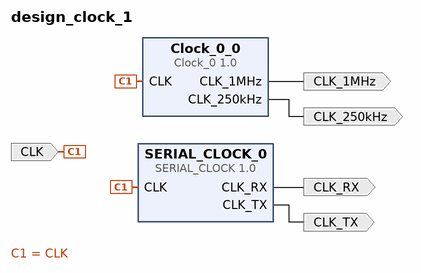
[diagram p0: block diagram of the top level]
# Vivado block design design_clock_1, xc7z020clg400-2, Vivado 2019.1
create_bd_design design_clock_1

create_bd_port -dir O CLK_RX
create_bd_port -dir O CLK_TX
create_bd_port -dir I -type clk CLK
create_bd_port -dir O CLK_250kHz
create_bd_port -dir O CLK_1MHz

create_bd_cell -type ip -vlnv xilinx.com:user:SERIAL_CLOCK:1.0 SERIAL_CLOCK_0
create_bd_cell -type ip -vlnv xilinx.com:user:Clock_0:1.0 Clock_0_0

# ---- connections ----

connect_bd_net [get_bd_pins SERIAL_CLOCK_0/CLK_RX] [get_bd_ports CLK_RX]
connect_bd_net [get_bd_pins SERIAL_CLOCK_0/CLK_TX] [get_bd_ports CLK_TX]
connect_bd_net -net CLK_0_1 [get_bd_ports CLK] [get_bd_pins SERIAL_CLOCK_0/CLK] [get_bd_pins Clock_0_0/CLK]
connect_bd_net [get_bd_pins Clock_0_0/CLK_250kHz] [get_bd_ports CLK_250kHz]
connect_bd_net [get_bd_pins Clock_0_0/CLK_1MHz] [get_bd_ports CLK_1MHz]

validate_bd_design
save_bd_design
